# EAGLE design Grove - PH Sensor v1.0 (EAGLE 6.3)
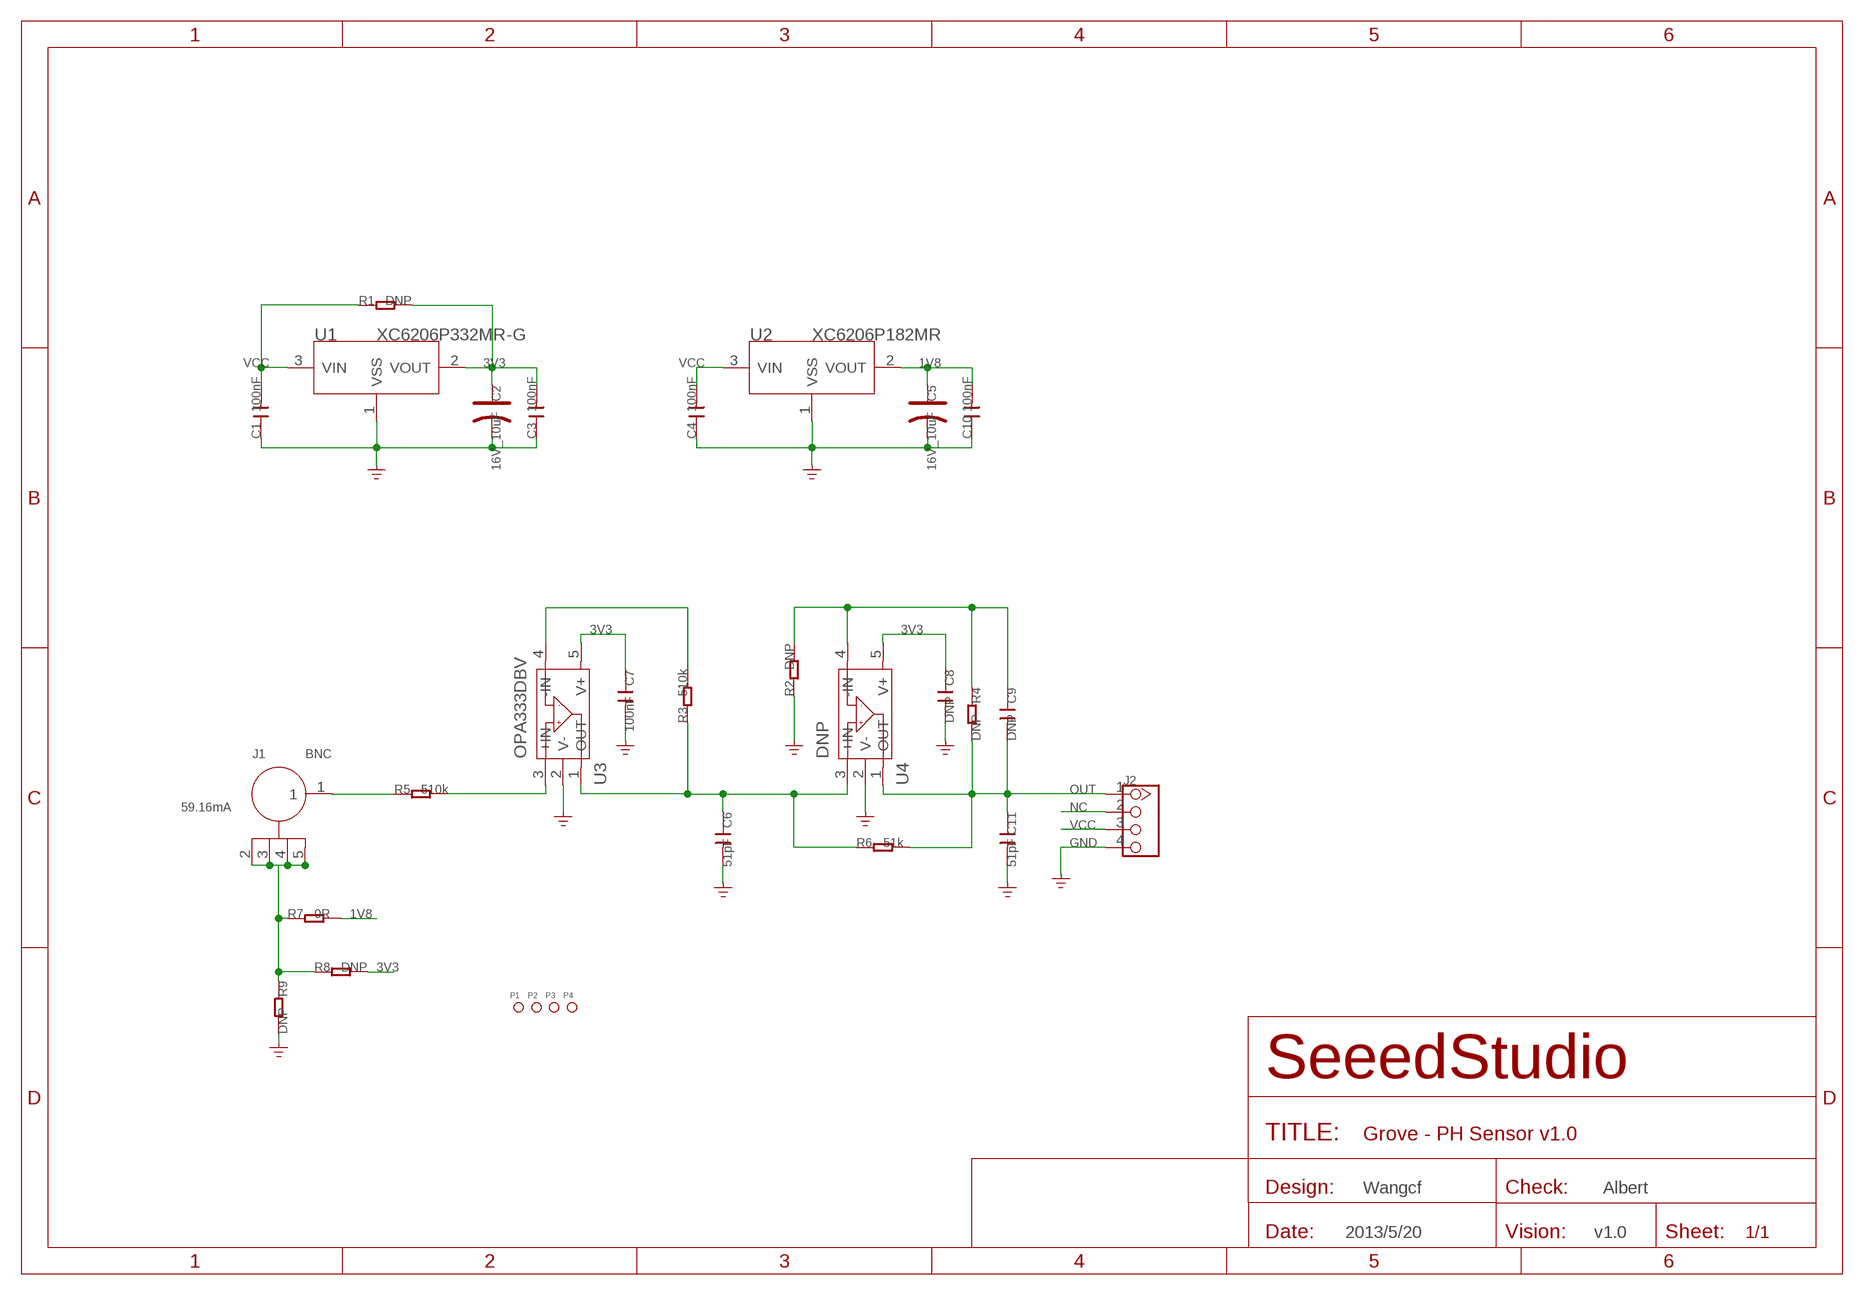
[diagram p0: schematic, sheet 1]

## Parts
C1  100nF  C-0603  [C0603]
C2  16V_10uF  CAP-AVX-A  [AVX-A]
C3  100nF  C-0603  [C0603]
C4  100nF  C-0603  [C0603]
C5  16V_10uF  CAP-AVX-A  [AVX-A]
C6  51pF  C-0603  [C0603]
C7  100nF  C-0603  [C0603]
C8  DNP  C-0603  [C0603]
C9  DNP  C-0603  [C0603]
C10  100nF  C-0603  [C0603]
C11  51pF  C-0603  [C0603]
J1  BNC  BNC'BNC-KYWE-1'  [2P-10X10X12H-90D]
J2  TWIG-4P-2.0-2.0  [4P-2.0]
P1  PAD-MARK  [ROUND-MARK-1.0]
P2  PAD-MARK  [ROUND-MARK-1.0]
P3  PAD-MARK  [ROUND-MARK-1.0]
P4  PAD-MARK  [ROUND-MARK-1.0]
R1  DNP  R-0603  [R0603]
R2  DNP  R-0603  [R0603]
R3  510k  R-0603  [R0603]
R4  DNP  R-0603  [R0603]
R5  510k  R-0603  [R0603]
R6  51k  R-0603  [R0603]
R7  0R  R-0603  [R0603]
R8  DNP  R-0603  [R0603]
R9  DNP  R-0603  [R0603]
U1  XC6206P332MR-G  XC6206MR  [SOT23]
U2  XC6206P182MR  XC6206MR  [SOT23]
U3  OPA333DBV  [SOT23-5]
U4  DNP  OPA333DBV  [SOT23-5]

## Nets
1V8: C5.+ C10.2 R7.2 U2.2(VOUT)
3V3: C2.+ C3.2 C7.1 C8.1 R1.2 R8.2 U1.2(VOUT) U3.5(V+) U4.5(V+)
GND: C1.1 C2.- C3.1 C4.1 C5.- C6.2 C7.2 C8.2 C10.1 C11.2 J2.4 R2.1 R9.2 U1.1(VSS) U2.1(VSS) U3.2(V-) U4.2(V-)
N$1: J1.1 R5.1
N$2: R5.2 U3.3(+IN)
N$3: C6.1 R3.1 R6.1 U3.1(OUT) U4.3(+IN)
N$4: R3.2 U3.4(-IN)
N$9: C9.1 R2.2 R4.1 U4.4(-IN)
N$17: J1.2 J1.3 J1.4 J1.5 R7.1 R8.1 R9.1
NC: J2.2
OUT: C9.2 C11.1 J2.1 R4.2 R6.2 U4.1(OUT)
VCC: C1.2 C4.2 J2.3 R1.1 U1.3(VIN) U2.3(VIN)

## Notes on the sheet
- 59.16mA
- Wangcf | Albert
- 2013/5/20 | v1.0

## Library data of the parts
C1 C3 C4 C6-C11 = Discrete:C*: Ceramic Capacitors
C2 C5 = Discrete:CAP*: Electrolytic Capacitors,Tantalum Capacitors and Super Capacitors
J1 = template:BNC
J2 = Connector:TWIG-4P-2.0
P1-P4 = Discrete:PAD-MARK; PARTNO: DNP
R1-R9 = Discrete:R*
U1 U2 = IC:XC6206: LOW ESR Cap.Compatible Positive Voltage Regulators
U3 U4 = IC:OPA333: 1.8V,Micro power CMOS oprational amplifiers Zero-Drift Series http://www.ti.com.cn/cn/lit/ds/symlink/opa333.pdf

## Net classes
0 default: width 0.152 mm, drill 0.305 mm, clearance 0.152 mm

## Board
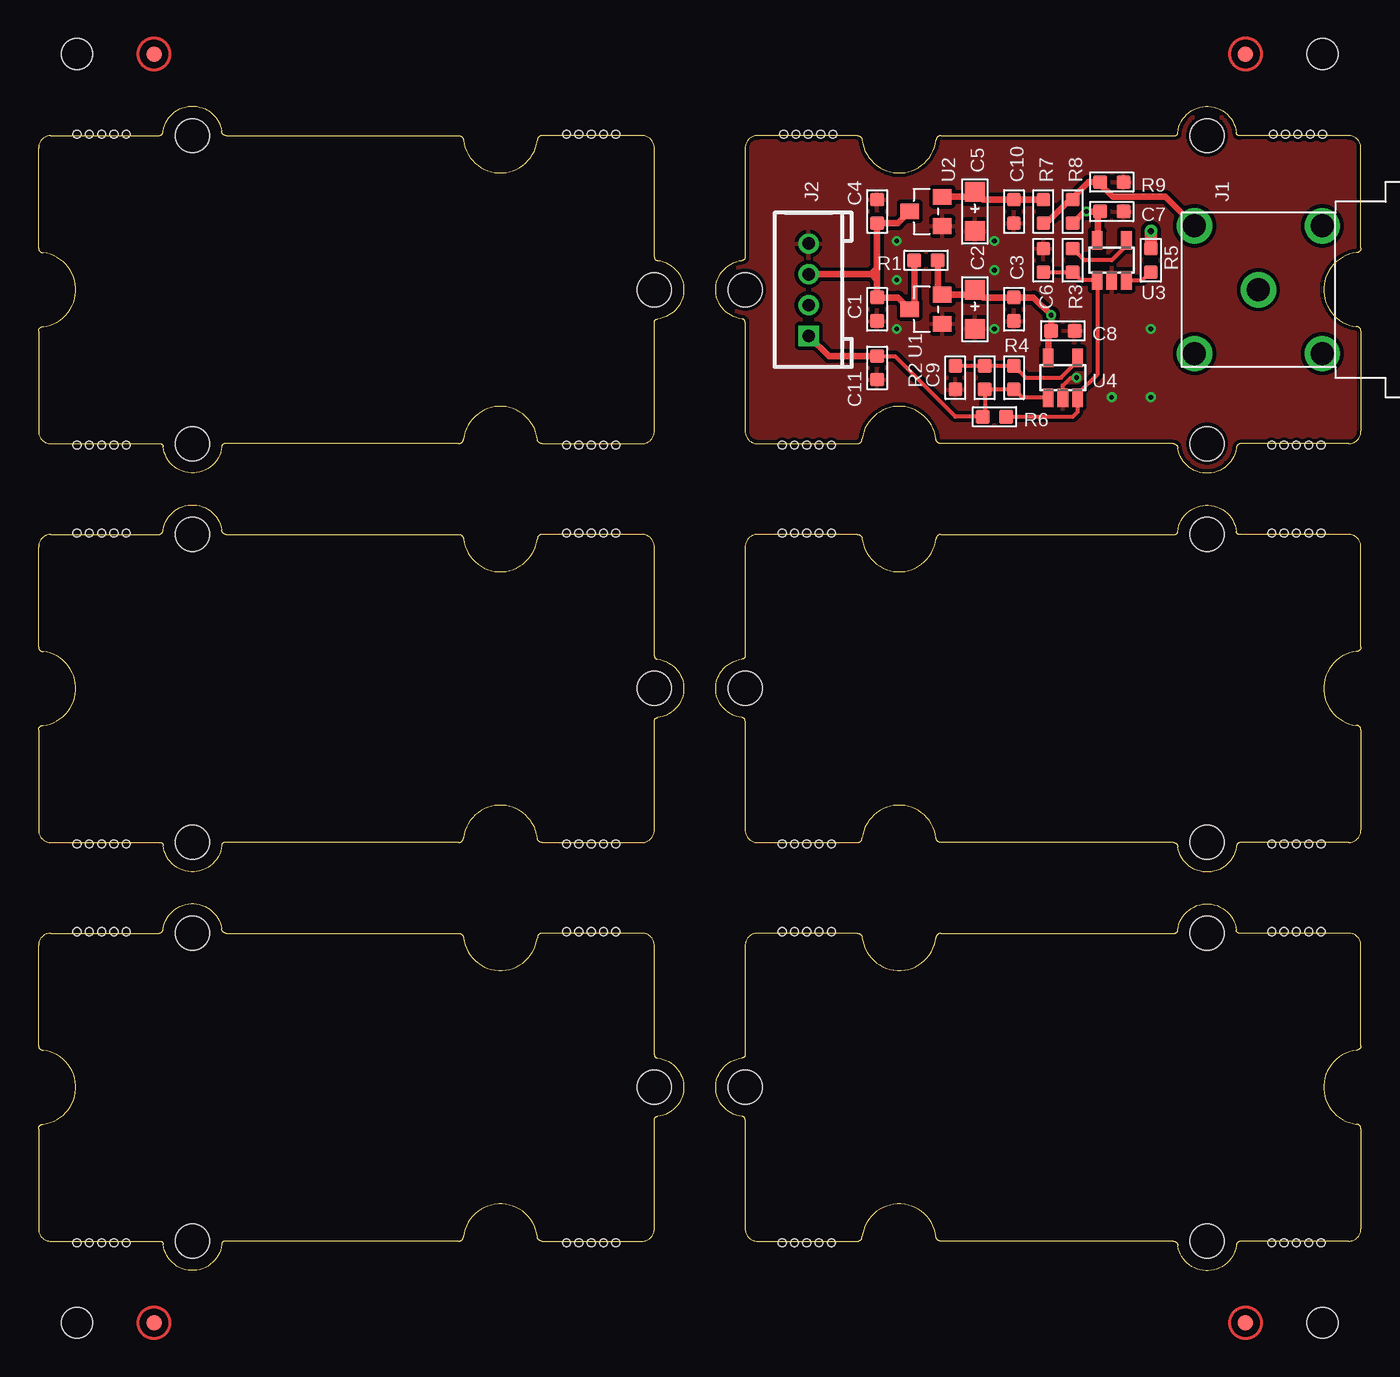
[diagram p1: board, top side]
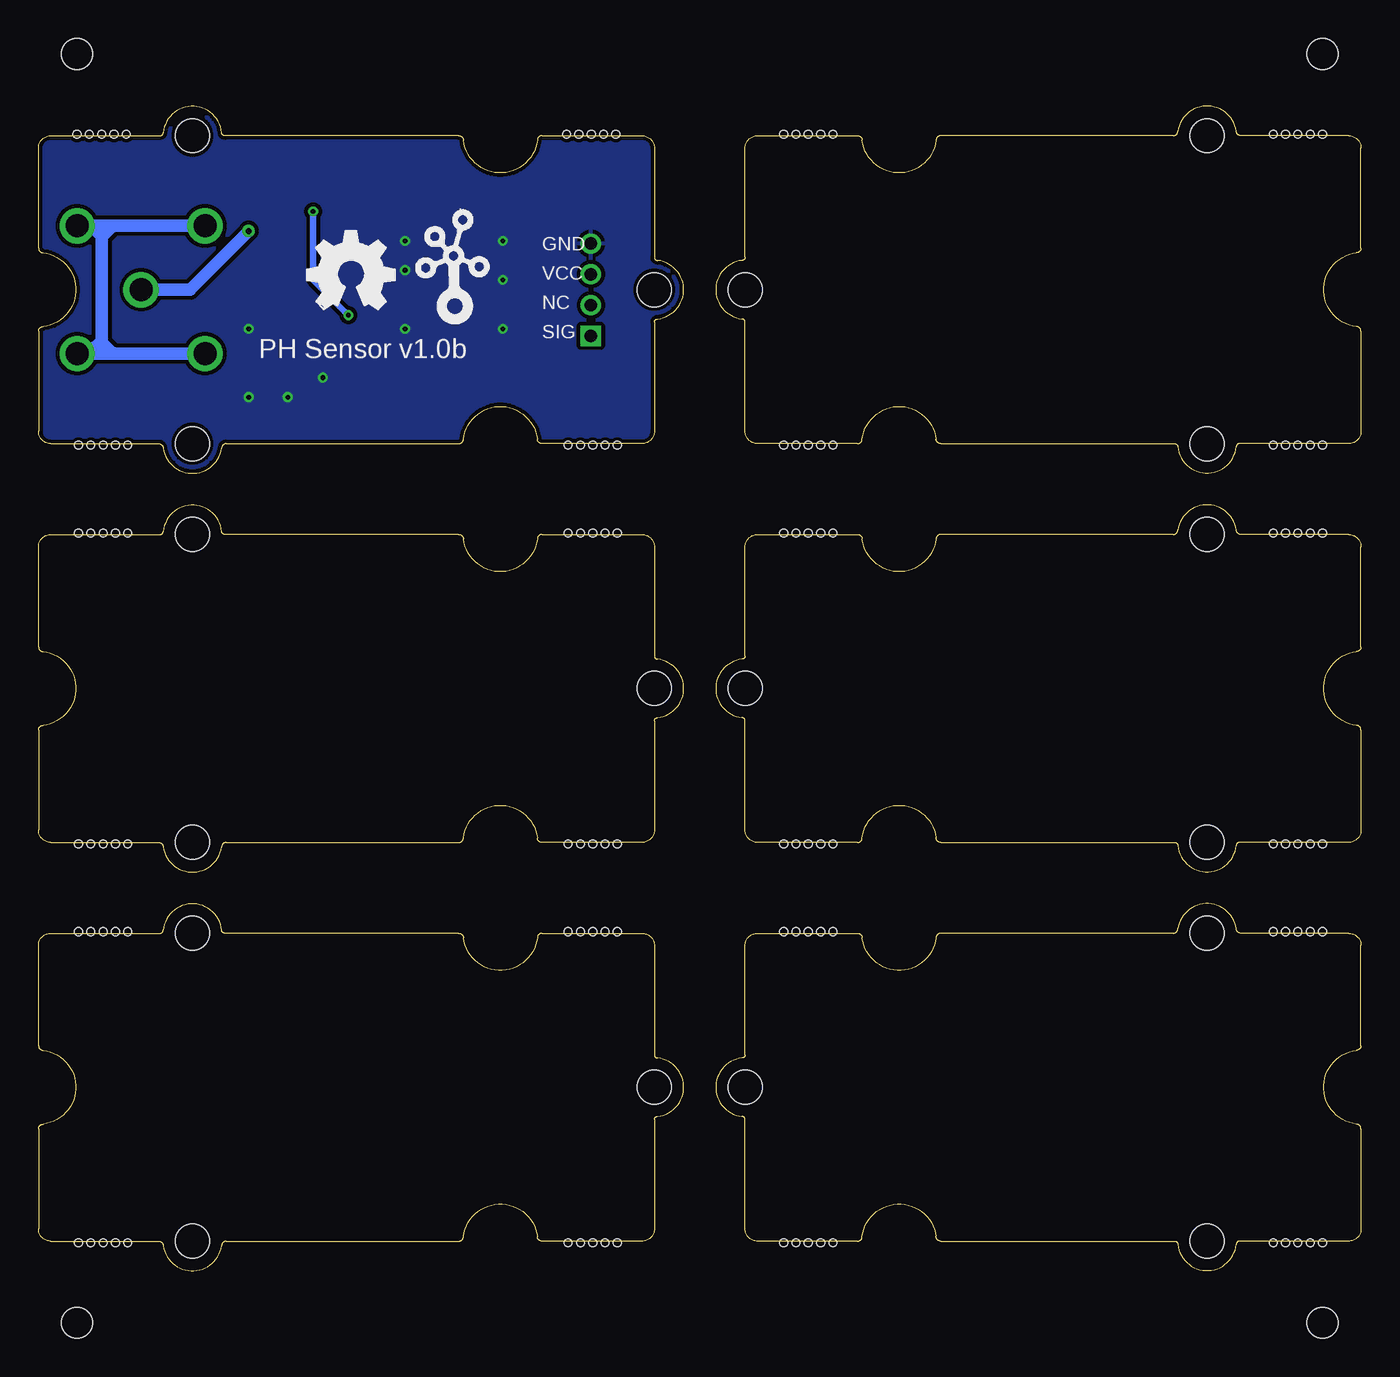
[diagram p2: board, bottom side, seen from below]

Size 85.9 x 75.64 mm. Coordinates in mm from the lower left corner, seen from the top.
Copper layers (1*16): Top 0.035mm / dielectric 1.5mm / Bottom 0.035mm
Design rules "SeeedStudio_rule_no_angle_090911 *": minimum track width 6mil, minimum drill 12mil, track to track 6mil, track to pad 6mil, pad to pad 6mil, via to via 6mil, smd to smd 0mil, copper to edge 10mil, drill to drill 10mil, minimum pad ring 10mil, minimum via ring 6mil, stop-mask expansion 2mil, vias tented up to drill 25mil, thermal gap 10mil
Holes 0.5 mm at 48.4,73.82 49.2,73.82 50,73.82 50.8,73.82 51.6,73.82 80.2,73.82 81,73.82 81.8,73.82 82.6,73.82 83.4,73.82 2.5,73.82 3.3,73.82 4.1,73.82 4.9,73.82 5.7,73.82 34.3,73.82 35.1,73.82 35.9,73.82 36.7,73.82 37.5,73.82 37.5,1.82 36.7,1.82 35.9,1.82 35.1,1.82 34.3,1.82 5.7,1.82 4.9,1.82 4.1,1.82 3.3,1.82 2.5,1.82 83.3,1.82 82.5,1.82 81.7,1.82 80.9,1.82 80.1,1.82 51.5,1.82 50.7,1.82 49.9,1.82 49.1,1.82 48.3,1.82 37.5,27.72 36.7,27.72 35.9,27.72 35.1,27.72 34.3,27.72 5.7,27.72 4.9,27.72 4.1,27.72 3.3,27.72 2.5,27.72 83.3,27.72 82.5,27.72 81.7,27.72 80.9,27.72 80.1,27.72 51.5,27.72 50.7,27.72 49.9,27.72 49.1,27.72 48.3,27.72 5.7,22.02 4.9,22.02 4.1,22.02 3.3,22.02 2.5,22.02 37.5,22.02 36.7,22.02 35.9,22.02 35.1,22.02 34.3,22.02 51.5,22.02 50.7,22.02 49.9,22.02 49.1,22.02 48.3,22.02 83.3,22.02 82.5,22.02 81.7,22.02 80.9,22.02 80.1,22.02 37.5,53.62 36.7,53.62 35.9,53.62 35.1,53.62 34.3,53.62 5.7,53.62 4.9,53.62 4.1,53.62 3.3,53.62 2.5,53.62 83.3,53.62 82.5,53.62 81.7,53.62 80.9,53.62 80.1,53.62 51.5,53.62 50.7,53.62 49.9,53.62 49.1,53.62 48.3,53.62 5.7,47.92 4.9,47.92 4.1,47.92 3.3,47.92 2.5,47.92 37.5,47.92 36.7,47.92 35.9,47.92 35.1,47.92 34.3,47.92 51.5,47.92 50.7,47.92 49.9,47.92 49.1,47.92 48.3,47.92 83.3,47.92 82.5,47.92 81.7,47.92 80.9,47.92 80.1,47.92
Holes 2 mm at 2.5,79.02 83.4,79.02 2.5,-3.38 83.4,-3.38

### Footprints (pad centres in the part's own frame; a part is rotated, then mirrored left to right if it is on the bottom)
C0603 = smd 0.889 x 0.889: 1 -0.762,0; 2 0.762,0
AVX-A = smd 1.27 x 1.27: + -1.27,0; - 1.27,0
2P-10X10X12H-90D = drill 1.5 pad 2.3: 1 0,0; 2 -4.15,-4.15; 3 4.15,-4.15; 4 4.15,4.15; 5 -4.15,4.15
4P-2.0 = drill 0.8 pad 1.27 square: 1 -3,0 | drill 0.8 pad 1.27: 2 -1,0; 3 1,0; 4 3,0
ROUND-MARK-1.0 = smd 1.016 x 1.016: P$1 0,0
R0603 = smd 0.889 x 0.889: 1 -0.762,0; 2 0.762,0
SOT23 = smd 1.016 x 1.2: 1 -0.95,-1.06; 2 0.95,-1.06; 3 0,1.06
SOT23-5 = smd 0.69 x 1.2: 1 -0.95,-1.3; 2 0,-1.3; 3 0.95,-1.3; 4 0.95,1.3; 5 -0.95,1.3
2U-DIM-W/DRILL = hole 2.2: -10,-10; -10,10; 20,0

### Placement (x,y rotation side)
C1  54.47,62.45 90 top
C2  60.82,62.45 270 top
C3  63.36,62.45 90 top
C4  54.47,68.8 270 top
C5  60.82,68.8 270 top
C6  65.27,65.63 90 top
C7  69.71,68.8 0 top
C8  66.54,61.05 0 top
C9  61.46,58.01 270 top
C10  63.36,68.8 90 top
C11  54.47,58.64 270 top
J1  79.24,63.72 0 top
J2  50.03,63.72 90 top
P1  7.5,-3.38 0 top  (outside the outline)
P2  78.4,-3.38 0 top  (outside the outline)
P3  78.4,79.02 0 top  (outside the outline)
P4  7.5,79.02 0 top  (outside the outline)
R1  57.65,65.63 0 top
R2  59.55,58.01 90 top
R3  67.17,65.63 90 top
R4  63.36,58.01 270 top
R5  72.25,65.63 270 top
R6  62.09,55.47 180 top
R7  65.27,68.8 90 top
R8  67.17,68.8 270 top
R9  69.71,70.71 0 top
U1  57.65,62.45 90 top
U2  57.65,68.8 90 top
U3  69.71,65.63 0 top
U4  66.54,58.01 0 top
U$12  [2U-DIM-W/DRILL]  65.9,63.72 180 top
U$13  [OSHW_FILLX200_NOTEXT]  68.44,62.45 0 bottom
U$14  [TWIGLOGO]  58.92,62.45 0 bottom
U$16  [2U-DIM-W/DRILL]  20,63.72 0 top
U$17  [2U-DIM-W/DRILL]  20,11.92 0 top
U$18  [2U-DIM-W/DRILL]  65.9,11.92 180 top
U$19  [2U-DIM-W/DRILL]  20,37.82 0 top
U$20  [2U-DIM-W/DRILL]  65.9,37.82 180 top

### Tracks (layer width: path | path; a pad name or v marks a point on that pad's centre or on a via)
1V8
  Top 0.406: U2.2 60.5,69.75 C5.+ 61.33,69.56 C10.2 R7.2
3V3  (via drill 0.3 pad 0.64)
  Top 0.406: R1.2 58.41,63.7 U1.2 60.5,63.4 C2.+ 61.33,63.21 C3.2 64.63,63.21 v65.77,62.07 65.77,61.82 C8.1 65.59,60.87 U4.5 | U3.5 68.82,66.99 68.82,68.67 C7.1 v68.06,68.8 67.93,68.8 R8.2
  Bottom 0.406: v68.06,68.8 68.06,64.36 v65.77,62.07
GND  (via drill 0.3 pad 0.64)
  Top 0.254: U4.2 66.54,57.5 67.04,58.01 v67.42,58.01
  other vias: 55.74,61.18 62.09,61.18 69.71,56.74 55.74,66.9 62.09,66.9 62.09,64.99 55.74,64.36 72.25,61.18 72.25,56.74
  pour Bottom (isolate 0.254): 43.68,51.66 86.22,51.66 86.22,75.79 43.68,75.79 43.68,51.91
  pour Top (isolate 0.254): 43.68,51.66 86.22,51.66 86.22,75.79 43.68,75.79 43.68,51.91
N$1  (via drill 0.38 pad 0.81)
  Top 0.813: v72.25,67.53 R5.1
  Bottom 0.813: J1.1 76.06,63.72 v72.25,67.53
N$2
  Top 0.254: U3.3 71.71,64.33 R5.2
N$3
  Top 0.254: C6.1 R3.1 67.71,64.33 U3.1 68.76,58.2 67.55,56.99 67.55,56.77 U4.3 67.48,55.78 67.17,55.47 R6.1
N$4
  Top 0.254: R3.2 67.93,65.63 69.71,65.63 70.66,66.58 U3.4
N$9
  Top 0.254: U4.4 67.42,59.25 67.42,59.02 66.41,58.01 64.12,58.01 R4.1 C9.1 R2.2
N$17
  Top 0.406: R7.1 65.46,68.04 66.98,69.56 R8.1 67.17,69.69 68.19,70.71 R9.1 68.95,70.58 69.77,69.75 73.2,69.75 J1.5
  Bottom 0.813: J1.5 81.8,67.87 | 81.8,67.87 J1.4 | J1.2 81.9,59.57 | 81.9,59.57 J1.3 | 81.8,67.87 81.8,67.18 | 81.8,67.12 81.8,60.39 | 81.8,60.32 81.8,59.67 81.9,59.57 | 81.8,60.39 82.41,59.78 | 81.8,60.39 81.8,60.32 | 81.8,60.32 81.14,59.66 | 81.8,67.12 81.14,67.79 | 81.8,67.12 81.8,67.18 | 81.8,67.18 82.54,67.91
OUT
  Top 0.254: U4.1 63.9,56.71 R4.2 C9.2 61.46,55.47 R6.2 59.55,55.47 55.61,59.4 C11.1
  Top 0.406: C11.1 51.34,59.4 J2.1
VCC
  Top 0.406: 54.47,65.12 C4.2 55.82,68.04 U2.3 | 54.47,65.12 54.47,64.74 | 54.47,64.74 54.47,64.36 | 54.47,64.36 C1.2 55.82,63.21 U1.3 56.88,62.75 R1.1 | J2.3 53.84,64.72 54.07,64.72 | 54.07,64.72 54.45,64.72 54.47,64.74 | 54.07,64.72 54.47,65.12 | 54.07,64.72 54.11,64.72 54.47,64.36

### Text on the board
bPlace: GND | VCC | NC | SIG | PH Sensor v1.0b